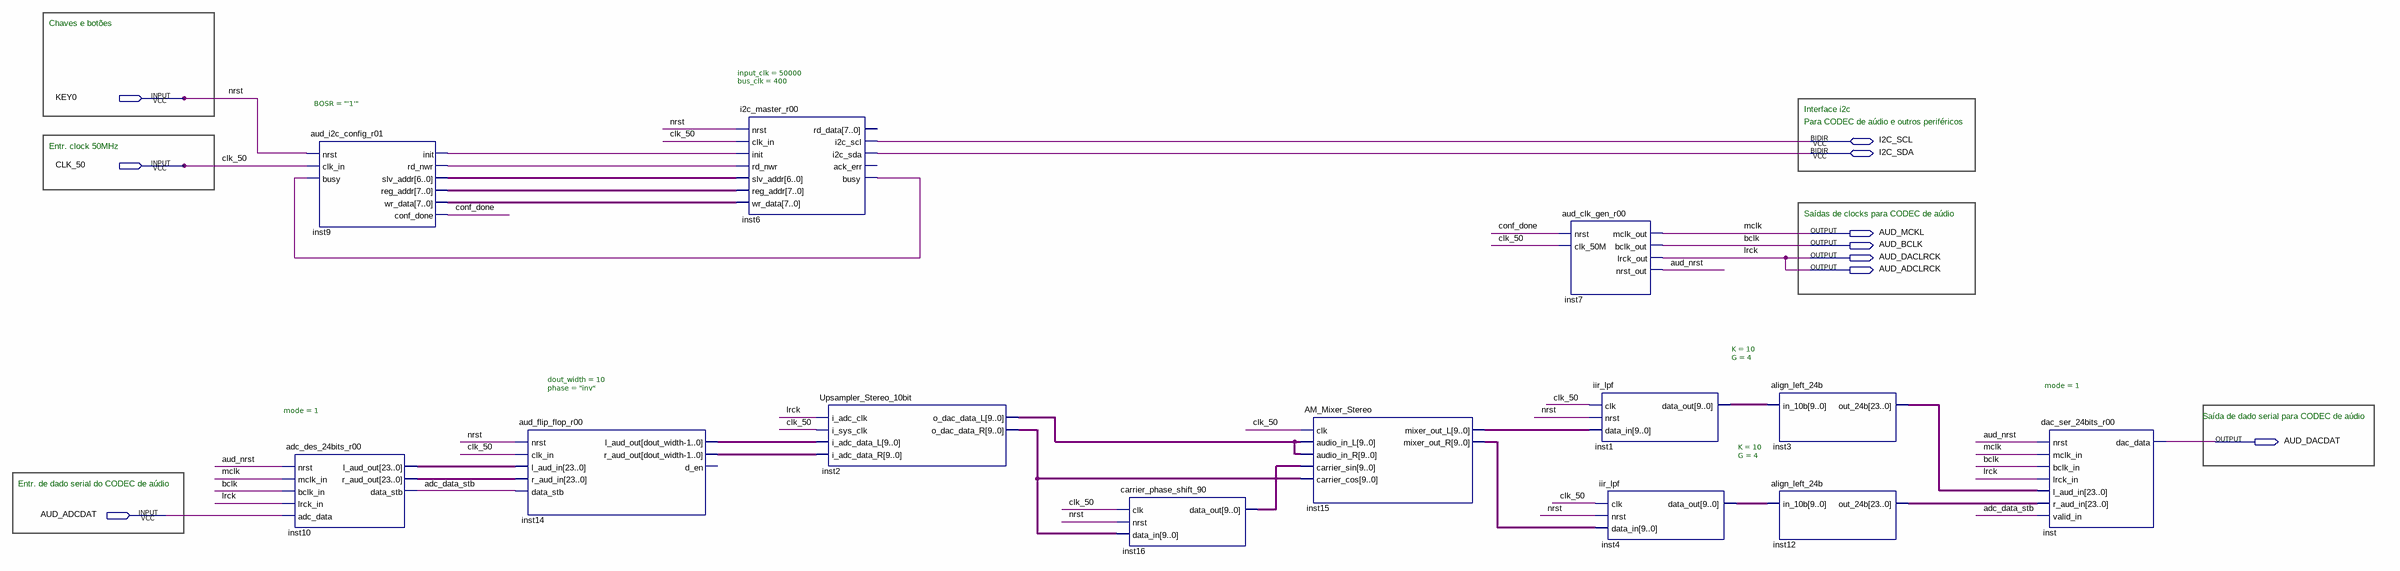
[diagram p0: schematic sheet]
// Quartus schematic de2_modula.bdf as structural Verilog: 13 symbols, 10 pins
module de2_modula (
  input  KEY0,
  input  CLK_50,
  input  AUD_ADCDAT,
  inout  I2C_SCL,
  inout  I2C_SDA,
  output AUD_MCKL,
  output AUD_BCLK,
  output AUD_DACLRCK,
  output AUD_ADCLRCK,
  output AUD_DACDAT
);

  wire adc_data_stb, aud_nrst, conf_done, inst6_busy, inst9_init, inst9_rd_nwr;
  wire [6:0] inst9_slv_addr;
  wire [7:0] inst9_reg_addr, inst9_wr_data;
  wire [9:0] inst1_data_out, inst2_o_dac_data_l, inst2_o_dac_data_r, inst4_data_out, inst14_l_aud_out,
       inst14_r_aud_out, inst15_mixer_out_l, inst15_mixer_out_r, inst16_data_out;
  wire [23:0] inst3_out_24b, inst10_l_aud_out, inst10_r_aud_out, inst12_out_24b;

  aud_i2c_config_r01 #(.BOSR("'1'")) inst9 (
    .nrst(KEY0), .clk_in(CLK_50), .busy(inst6_busy), .init(inst9_init), .rd_nwr(inst9_rd_nwr),
    .slv_addr(inst9_slv_addr), .reg_addr(inst9_reg_addr), .wr_data(inst9_wr_data), .conf_done(conf_done));
  adc_des_24bits_r00 #(.mode(1)) inst10 (
    .nrst(aud_nrst), .mclk_in(AUD_MCKL), .bclk_in(AUD_BCLK), .lrck_in(AUD_ADCLRCK), .adc_data(AUD_ADCDAT),
    .l_aud_out(inst10_l_aud_out), .r_aud_out(inst10_r_aud_out), .data_stb(adc_data_stb));
  aud_flip_flop_r00 #(.dout_width(10), .phase("inv")) inst14 (
    .nrst(KEY0), .clk_in(CLK_50), .l_aud_in(inst10_l_aud_out), .r_aud_in(inst10_r_aud_out),
    .data_stb(adc_data_stb), .l_aud_out(inst14_l_aud_out), .r_aud_out(inst14_r_aud_out));  // open: d_en
  i2c_master_r00 #(.input_clk(50000), .bus_clk(400)) inst6 (
    .nrst(KEY0), .clk_in(CLK_50), .init(inst9_init), .rd_nwr(inst9_rd_nwr), .slv_addr(inst9_slv_addr),
    .reg_addr(inst9_reg_addr), .wr_data(inst9_wr_data), .busy(inst6_busy), .i2c_scl(I2C_SCL),
    .i2c_sda(I2C_SDA));  // open: rd_data, ack_err
  Upsampler_Stereo_10bit inst2 (
    .i_adc_clk(AUD_ADCLRCK), .i_sys_clk(CLK_50), .i_adc_data_L(inst14_l_aud_out),
    .i_adc_data_R(inst14_r_aud_out), .o_dac_data_L(inst2_o_dac_data_l), .o_dac_data_R(inst2_o_dac_data_r));
  carrier_phase_shift_90 inst16 (.clk(CLK_50), .nrst(KEY0), .data_in(inst2_o_dac_data_r), .data_out(inst16_data_out));
  AM_Mixer_Stereo inst15 (
    .clk(CLK_50), .audio_in_L(inst2_o_dac_data_l), .audio_in_R(inst2_o_dac_data_l),
    .carrier_sin(inst16_data_out), .carrier_cos(inst2_o_dac_data_r), .mixer_out_L(inst15_mixer_out_l),
    .mixer_out_R(inst15_mixer_out_r));
  aud_clk_gen_r00 inst7 (
    .nrst(conf_done), .clk_50M(CLK_50), .mclk_out(AUD_MCKL), .bclk_out(AUD_BCLK), .lrck_out(AUD_ADCLRCK),
    .nrst_out(aud_nrst));
  iir_lpf #(.K(10), .G(4)) inst1 (.clk(CLK_50), .nrst(KEY0), .data_in(inst15_mixer_out_l), .data_out(inst1_data_out));
  iir_lpf #(.K(10), .G(4)) inst4 (.clk(CLK_50), .nrst(KEY0), .data_in(inst15_mixer_out_r), .data_out(inst4_data_out));
  align_left_24b inst3 (.in_10b(inst1_data_out), .out_24b(inst3_out_24b));
  align_left_24b inst12 (.in_10b(inst4_data_out), .out_24b(inst12_out_24b));
  dac_ser_24bits_r00 #(.mode(1)) inst (
    .nrst(aud_nrst), .mclk_in(AUD_MCKL), .bclk_in(AUD_BCLK), .lrck_in(AUD_ADCLRCK), .l_aud_in(inst3_out_24b),
    .r_aud_in(inst12_out_24b), .valid_in(adc_data_stb), .dac_data(AUD_DACDAT));

  assign AUD_DACLRCK = AUD_ADCLRCK;

  // Other names for the same wires on the sheet: lrck = AUD_ADCLRCK; bclk = AUD_BCLK; nrst = KEY0; mclk = AUD_MCKL

  // Notes on the sheet:
  //   Chaves e botões
  //   Interface i2c
  //   Para CODEC de aúdio e outros periféricos
  //   Entr. clock 50MHz
  //   Saídas de clocks para CODEC de aúdio
  //   Saída de dado serial para CODEC de aúdio
  //   Entr. de dado serial do CODEC de aúdio
endmodule
